# EAGLE design HDC100X-Breakout_v11 (EAGLE 7.3.0)
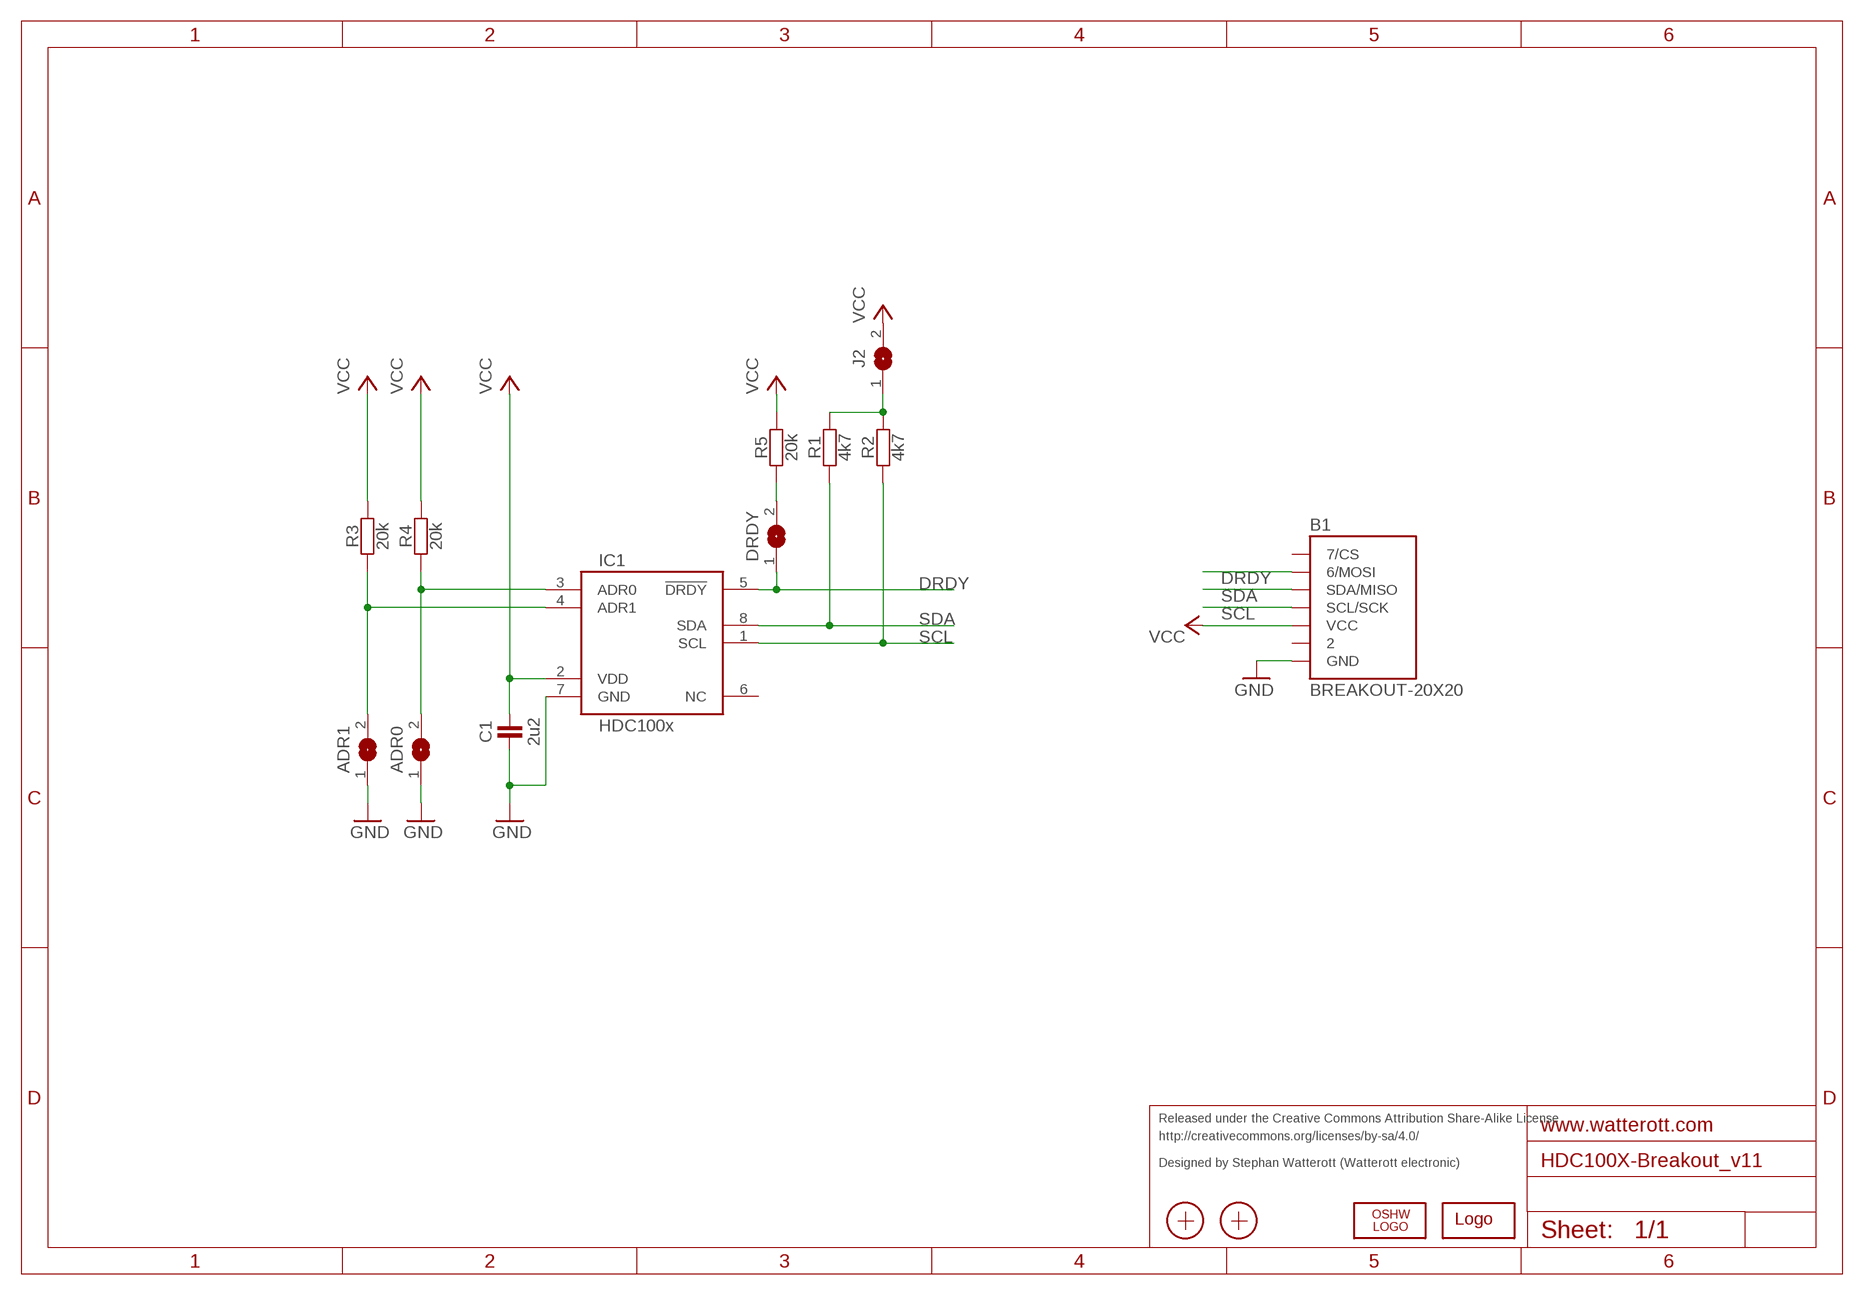
[diagram p0: schematic, sheet 1]

## Parts
ADR0  JUMPER2-0402  [JUMPER2-0402]
ADR1  JUMPER2-0402  [JUMPER2-0402]
B1  BREAKOUT-20X20  [BREAKOUT-20X20]
C1  2u2  CAPACITOR-C0402  [R0402]
DRDY  JUMPER2-0402  [JUMPER2-0402]
IC1  HDC100x  HDC1008  [WLCSP]
J2  JUMPER2-0603  [JUMPER2-0603]
LOGO2  OSHW_LOGOX0070  [OSHW_6X70]
LOGO3  LOGO-S_PLACE_M  [SPARK_TPLACE_M]
R1  4k7  RESISTOR-R0402  [R0402]
R2  4k7  RESISTOR-R0402  [R0402]
R3  20k  RESISTOR-R0402  [R0402]
R4  20k  RESISTOR-R0402  [R0402]
R5  20k  RESISTOR-R0402  [R0402]
X1  PASSER-07  [PASSER_07MM]
X2  PASSER-07  [PASSER_07MM]

## Nets
ADR0: ADR0.2 IC1.3(ADR0) R4.1
ADR1: ADR1.2 IC1.4(ADR1) R3.1
DRDY: B1.MOSI(6/MOSI) DRDY.1 IC1.5(!DRDY)
GND: ADR0.1 ADR1.1 B1.GND C1.1 IC1.7(GND)
N$1: J2.1 R1.2 R2.2
N$3: DRDY.2 R5.1
SCL: B1.SCL/SCK IC1.1(SCL) R2.1
SDA: B1.SDA/MISO IC1.8(SDA) R1.1
VCC: B1.VCC C1.2 IC1.2(VDD) J2.2 R3.2 R4.2 R5.2
Unconnected: B1.2 B1.CS(7/CS) IC1.6(NC)

## Notes on the sheet
- Released under the Creative Commons Attribution Share-Alike License
- http://creativecommons.org/licenses/by-sa/4.0/
- Designed by Stephan Watterott (Watterott electronic)

## Library data of the parts
ADR0 ADR1 DRDY J2 = we-rcl:JUMPER2: 2 Pin Jumpers
B1 = we-board:BREAKOUT
C1 = we-rcl:CAPACITOR: Capacitors ...4.7uF @ 6.3V -> 0402 ...10uF @ 16V -> 0603 ...22uF @ 25V -> 0805
IC1 = we-chip:HDC1008: TI HDC1008 Integrated Low Power Digital Humidity Sensor with Integrated Temperature Sensor; DIGIKEY: 296-38440
LOGO2 = we-symbol:OSHW_LOGO: Open-Source-Hardware Logo
LOGO3 = we-symbol:LOGO: Watterott electronic Logo
R1-R5 = we-rcl:RESISTOR: Resistors all kinds in 0603 and 0402
X1 X2 = we-symbol:PASSER: Fiducial Markers

## Board
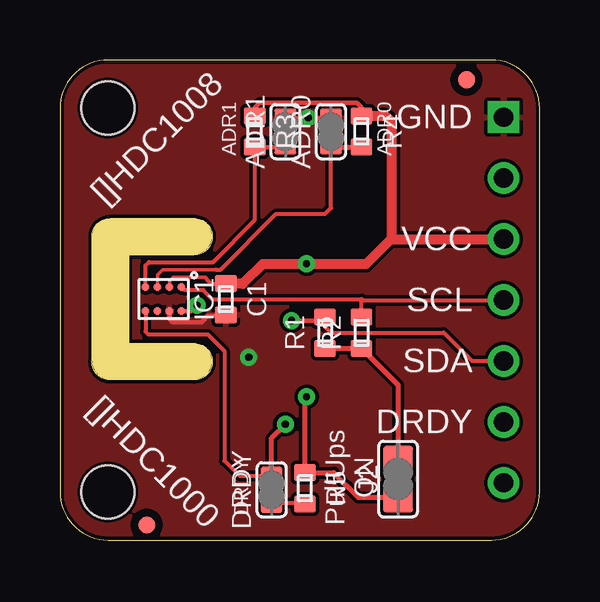
[diagram p1: board, top side]
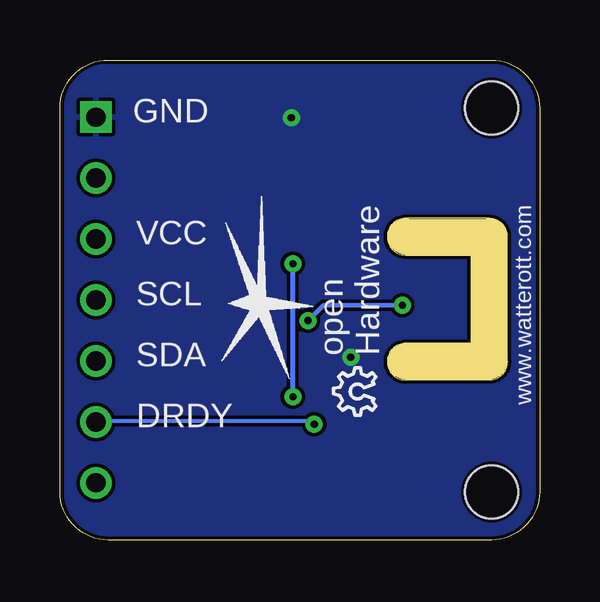
[diagram p2: board, bottom side, seen from below]

Size 20 x 20 mm. Coordinates in mm from the lower left corner, seen from the top.
Outline: 5.59,6.67 5.52,6.67
Outline: 5.52,6.67 2.03,6.67 arc-90 1.33,7.49 1.33,12.64 arc-90 2.1,13.4 5.65,13.4 arc-180 5.52,11.87 2.86,11.87 2.86,8.19 5.65,8.19 arc-180 5.52,6.67
Copper layers (1*16): Top 0.035mm / dielectric 1.5mm / Bottom 0.035mm
Design rules "watterott *": minimum track width 0.15mm, minimum drill 0.3mm, track to track 6mil, track to pad 6mil, pad to pad 6mil, via to via 6mil, smd to smd 0.1mm, copper to edge 6mil, drill to drill 8mil, minimum pad ring 10mil, minimum via ring 8mil, stop-mask expansion 4mil, vias tented up to drill 0.4mm, thermal gap 6mil
Milling: 3 lines

### Footprints (pad centres in the part's own frame; a part is rotated, then mirrored left to right if it is on the bottom)
JUMPER2-0402 = smd 0.9 x 0.8: 1 0,0.55; 2 0,-0.55
BREAKOUT-20X20 = drill 0.8: 2 18.5,15.08; CS 18.5,2.38; MOSI 18.5,4.92; SCL/SCK 18.5,10; SDA/MISO 18.5,7.46; VCC 18.5,12.54 | drill 0.8 square: GND 18.5,17.62 | hole 2.2: 2,18; 2,2
R0402 = smd 0.9 x 0.7: 1 0,0.65; 2 0,-0.65
WLCSP = smd 0.335 x 0.335: 1 -0.5,0.75; 2 -0.5,0.25; 3 -0.5,-0.25; 4 -0.5,-0.75; 5 0.5,-0.75; 6 0.5,-0.25; 7 0.5,0.25; 8 0.5,0.75
JUMPER2-0603 = smd 1.25 x 1.25: 1 0,0.76; 2 0,-0.76
PASSER_07MM = smd 0.7 x 0.7: X 0,0

### Placement (x,y rotation side)
ADR0  11.3,17.02 0 top
ADR1  9.4,17.02 0 top
B1  0,0 0 top
C1  6.92,10.03 180 top
DRDY  8.83,2.1 0 top
IC1  4.32,10.03 270 top
J2  14.1,2.54 0 top
LOGO2  6.81,5.2 90 bottom
LOGO3  11.68,9.91 90 bottom
R1  11.05,8.64 0 top
R2  12.57,8.64 0 top
R3  8.13,17.02 180 top
R4  12.57,17.02 180 top
R5  10.22,2.16 180 top
X1  16.95,19.18 0 top
X2  3.62,0.63 0 top

### Tracks (layer width: path | path; a pad name or v marks a point on that pad's centre or on a via)
ADR0
  Top 0.152: IC1.3 4.07,11.05 4.28,11.27 6.5,11.27
  Top 0.16: 6.5,11.27 6.69,11.27 9.02,13.59 11.05,13.59 11.3,13.84 ADR0.2
  Top 0.18: 12.06,16.34 11.3,16.34 ADR0.2 11.34,16.37 R4.1
ADR1
  Top 0.16: IC1.4 3.57,11.44 3.71,11.58 6.38,11.58 8.13,13.34 R3.1
  Top 0.18: R3.1 9.3,16.37 ADR1.2
DRDY  (via drill 0.3)
  Top 0.16: IC1.5 3.57,8.69 3.68,8.57 6.16,8.57 6.86,7.87 6.86,3.3 7.49,2.67 8.8,2.67 DRDY.1
  Top 0.2: DRDY.1 8.83,4.25 v9.4,4.83
  Bottom 0.16: 9.53,4.95 18.47,4.95 B1.MOSI
  Bottom 0.2: v9.4,4.83 9.53,4.95
GND  (via drill 0.3)
  Top 0.18: IC1.7 4.57,9.21 4.7,9.08 5.91,9.08 6.16,9.34 6.81,9.34 C1.1 | ADR1.1 ADR0.1
  other vias: 10.35,17.59 7.87,7.62
  pour Top: 0,0 0,20.07 19.81,20.07 20.07,19.81 20.07,0
  pour Bottom: 0,0 0,20.07 19.81,20.07 20.07,19.81 20.07,0
N$1
  Top 0.2: R1.2 R2.2 14.1,6.46 J2.1
N$2
  Top 0.254: 14.1,1.78 14.1,3.05
N$3
  Top 0.16: DRDY.2 10.19,1.55 R5.1
SCL
  Top 0.16: IC1.1 5.19,10.41 5.97,10.41 6.35,10.03 12.57,10.03 | R2.1 12.57,10.03 | 12.57,10.03 12.61,10 B1.SCL/SCK
  Top 0.18: IC1.1 5.09,10.53
SDA  (via drill 0.3)
  Top 0.16: R1.1 11.05,8.89 11.3,8.64 16,8.64 17.18,7.46 B1.SDA/MISO
  Top 0.18: IC1.8 5.47,9.53 v5.71,9.78 | v9.65,9.14 10.91,9.14 R1.1
  Bottom 0.18: v5.71,9.78 9.02,9.78 v9.65,9.14
VCC  (via drill 0.3)
  Top 0.152: IC1.2 4.57,10.79 4.72,10.95 6.06,10.95
  Top 0.16: 6.06,10.95 6.29,10.67 6.84,10.67
  Top 0.18: 6.84,10.67 C1.2 | R4.2 12.57,18.03 12.38,18.22 8.32,18.22 8.13,18.03 R3.2
  Top 0.2: v10.29,5.97 10.22,5.91 R5.2 11.41,2.81 12.45,1.78 J2.2
  Top 0.406: 13.84,12.57 12.78,11.51 v10.29,11.51 8.46,11.51 7.62,10.67 6.94,10.67 C1.2 | 13.84,12.57 13.84,17.4 13.59,17.65 12.59,17.65 R4.2 | 13.84,12.57 13.88,12.54 B1.VCC
  Bottom 0.2: v10.29,5.97 v10.29,11.51

### Text on the board
tPlace: GND | []HDC1008 | ADR1 | ADR0 | VCC | SCL | SDA | DRDY | []HDC1000 | PullUps / ON | DRDY
bPlace: GND | VCC | www.watterott.com | SCL | open / Hardware | SDA | DRDY